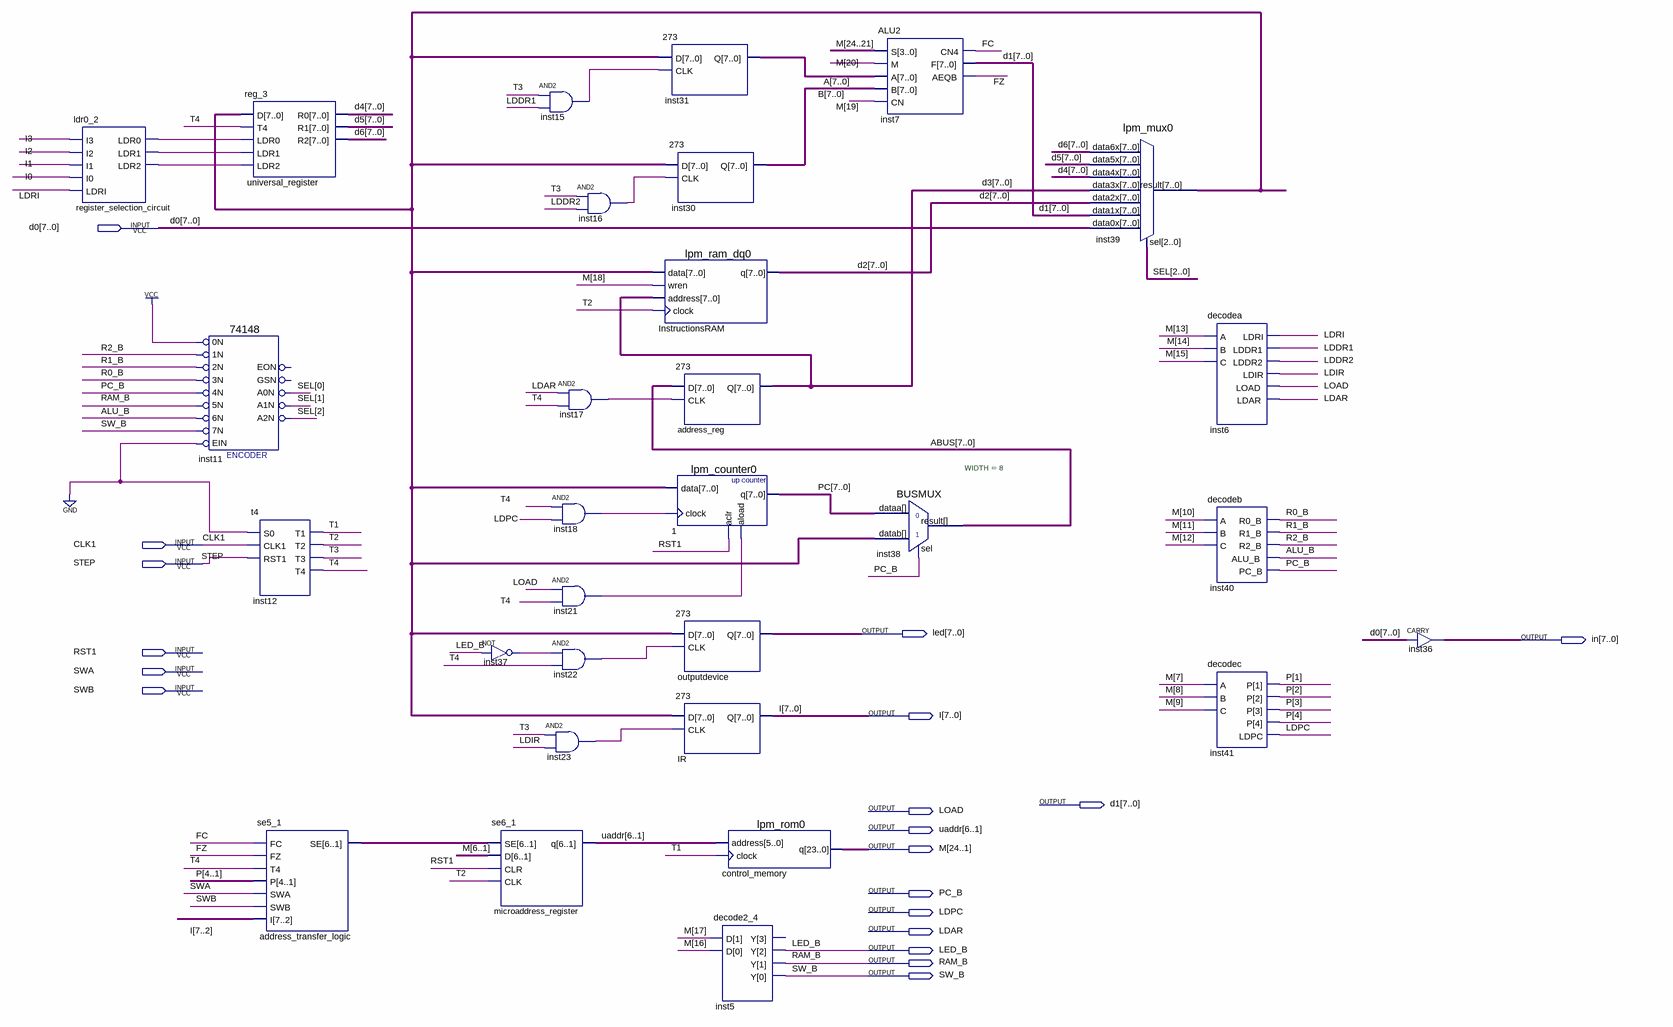
[diagram p0: schematic sheet]
// Quartus schematic project.bdf as structural Verilog: 30 symbols, 19 pins
module project (
  input  [7:0] d0,
  input  CLK1,
  input  STEP,
  input  RST1,
  input  SWA,
  input  SWB,
  output [7:0] led,
  output [7:0] in,
  output [7:0] I,
  output [7:0] d1,
  output LOAD,
  output [6:1] uaddr,
  output [24:1] M,
  output PC_B,
  output LDPC,
  output LDAR,
  output LED_B,
  output RAM_B,
  output SW_B
);

  wire ALU_B, FC, FZ, inst15_out, inst16_out, inst17_out, inst18_out, inst21_out, inst22_out, inst23_out,
       inst37_out, LDDR1, LDDR2, LDIR, LDRI, R0_B, R1_B, R2_B, register_selection_circuit_ldr0,
       register_selection_circuit_ldr1, register_selection_circuit_ldr2, T1, T2, T3, T4;
  wire [2:0] SEL;
  wire [4:1] P;
  wire [5:0] address_transfer_logic_se;
  wire [7:0] A, ABUS, B, d2, d3, d4, d5, d6, inst39_result, PC;
  wire [3:0] inst5_y_open;  // unused outputs

  ldr0_2 register_selection_circuit (
    .I3(I[3]), .I2(I[2]), .I1(I[1]), .I0(I[0]), .LDRI(LDRI), .LDR0(register_selection_circuit_ldr0),
    .LDR1(register_selection_circuit_ldr1), .LDR2(register_selection_circuit_ldr2));
  \74148  inst11 (
    .\5N (RAM_B), .\0N (1'b1), .\1N (R2_B), .\2N (R1_B), .\3N (R0_B), .\4N (PC_B), .EIN(1'b0), .\6N (ALU_B),
    .\7N (SW_B), .A1N(SEL[1]), .A0N(SEL[0]), .A2N(SEL[2]));  // open: EON, GSN
  reg_3 universal_register (
    .D(inst39_result), .T4(T4), .LDR0(register_selection_circuit_ldr0),
    .LDR1(register_selection_circuit_ldr1), .LDR2(register_selection_circuit_ldr2), .R0(d4), .R1(d5), .R2(d6));
  t4 inst12 (.S0(1'b0), .CLK1(CLK1), .RST1(STEP), .T1(T1), .T2(T2), .T3(T3), .T4(T4));
  se5_1 address_transfer_logic (
    .FC(FC), .FZ(FZ), .T4(T4), .P(P), .SWA(SWA), .SWB(SWB), .I(I[7:2]), .SE(address_transfer_logic_se));
  not inst37 (inst37_out, LED_B);
  se6_1 microaddress_register (.SE(address_transfer_logic_se), .D(M[6:1]), .CLR(RST1), .CLK(T2), .q(uaddr));
  and inst15 (inst15_out, T3, LDDR1);
  and inst16 (inst16_out, T3, LDDR2);
  and inst17 (inst17_out, LDAR, T4);
  and inst18 (inst18_out, T4, LDPC);
  and inst21 (inst21_out, LOAD, T4);
  and inst22 (inst22_out, inst37_out, T4);
  and inst23 (inst23_out, T3, LDIR);
  \273  inst31 (.D(inst39_result), .CLK(inst15_out), .Q(A));
  \273  inst30 (.D(inst39_result), .CLK(inst16_out), .Q(B));
  lpm_ram_dq0 InstructionsRAM (.data(inst39_result), .wren(M[18]), .address(d3), .clock(T2), .q(d2));
  \273  address_reg (.D(ABUS), .CLK(inst17_out), .Q(d3));
  lpm_counter0 u_1 (.data(inst39_result), .clock(inst18_out), .aclr(RST1), .aload(inst21_out), .q(PC));
  \273  outputdevice (.D(inst39_result), .CLK(inst22_out), .Q(led));
  \273  IR (.D(inst39_result), .CLK(inst23_out), .Q(I));
  lpm_rom0 control_memory (.address(uaddr), .clock(T1), .q(M));
  decode2_4 inst5 (.D(M[17:16]), .Y({inst5_y_open[3], LED_B, RAM_B, SW_B}));
  ALU2 inst7 (.S(M[24:21]), .M(M[20]), .A(A), .B(B), .CN(M[19]), .CN4(FC), .F(d1), .AEQB(FZ));
  BUSMUX #(.WIDTH(8)) inst38 (.datab(inst39_result), .sel(PC_B), .dataa(PC), .result(ABUS));
  lpm_mux0 inst39 (
    .data6x(d6), .data5x(d5), .data4x(d4), .data3x(d3), .data2x(d2), .data1x(d1), .data0x(d0), .sel(SEL),
    .result(inst39_result));
  decodea inst6 (
    .A(M[13]), .B(M[14]), .C(M[15]), .LDRI(LDRI), .LDDR1(LDDR1), .LDDR2(LDDR2), .LDIR(LDIR), .LOAD(LOAD),
    .LDAR(LDAR));
  decodeb inst40 (.A(M[10]), .B(M[11]), .C(M[12]), .R0_B(R0_B), .R1_B(R1_B), .R2_B(R2_B), .ALU_B(ALU_B), .PC_B(PC_B));
  decodec inst41 (.A(M[7]), .B(M[8]), .C(M[9]), .P(P), .LDPC(LDPC));
  CARRY inst36[7:0] (.IN(d0), .OUT(in));
endmodule
